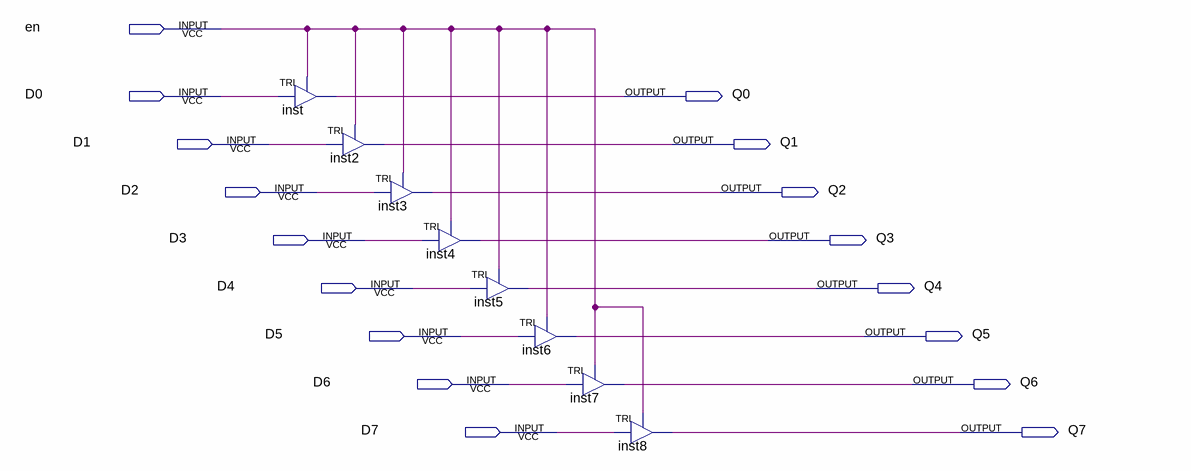
[diagram p0: schematic sheet]
// Quartus schematic en.bdf as structural Verilog: 8 symbols, 17 pins
module en (
  input  en,
  input  D0,
  input  D1,
  input  D2,
  input  D3,
  input  D4,
  input  D5,
  input  D6,
  input  D7,
  output Q0,
  output Q1,
  output Q2,
  output Q3,
  output Q4,
  output Q5,
  output Q6,
  output Q7
);

  TRI inst (.IN(D0), .OE(en), .OUT(Q0));
  TRI inst2 (.IN(D1), .OE(en), .OUT(Q1));
  TRI inst3 (.IN(D2), .OE(en), .OUT(Q2));
  TRI inst4 (.IN(D3), .OE(en), .OUT(Q3));
  TRI inst5 (.IN(D4), .OE(en), .OUT(Q4));
  TRI inst6 (.IN(D5), .OE(en), .OUT(Q5));
  TRI inst7 (.IN(D6), .OE(en), .OUT(Q6));
  TRI inst8 (.IN(D7), .OE(en), .OUT(Q7));
endmodule
